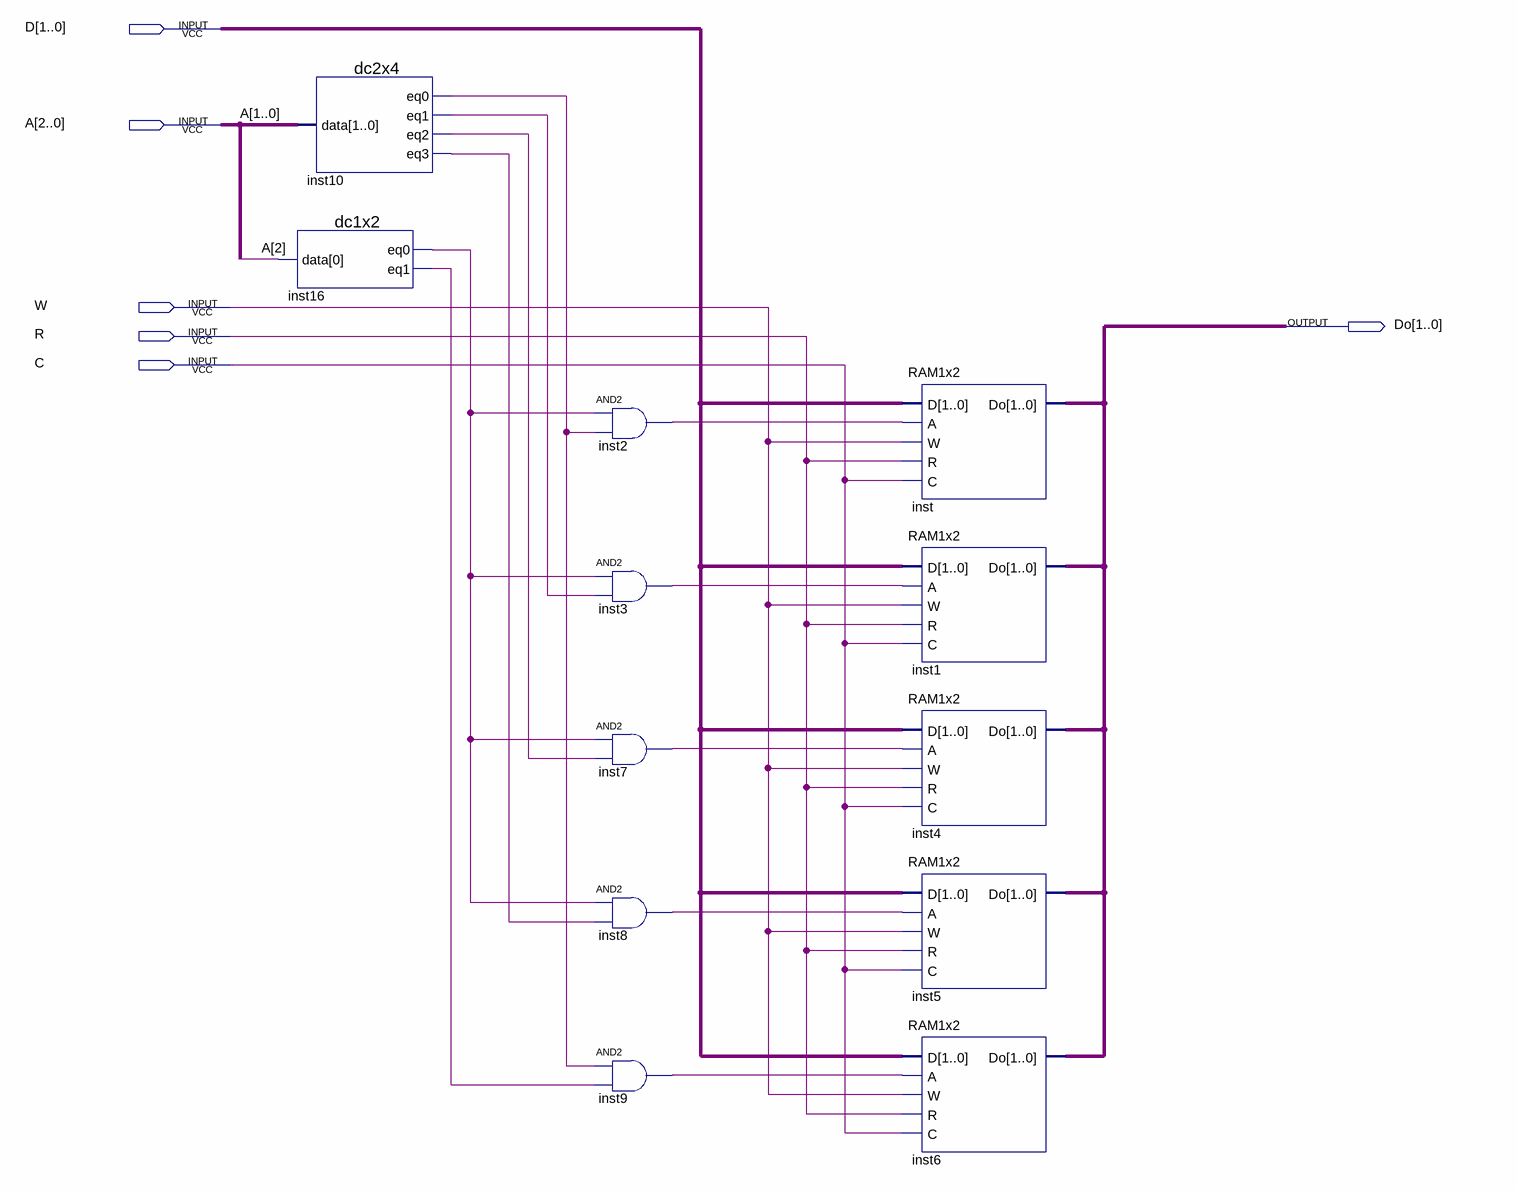
[diagram p0: schematic sheet]
// Quartus schematic RAM5x2_3D.bdf as structural Verilog: 12 symbols, 6 pins
module RAM5x2_3D (
  input  [1:0] D,
  input  [2:0] A,
  input  W,
  input  R,
  input  C,
  output [1:0] Do
);

  wire inst2_out, inst3_out, inst7_out, inst8_out, inst9_out, inst10_eq0, inst10_eq1, inst10_eq2, inst10_eq3,
       inst16_eq0, inst16_eq1;

  dc1x2 inst16 (.data(A[2]), .eq0(inst16_eq0), .eq1(inst16_eq1));
  dc2x4 inst10 (.data(A[1:0]), .eq0(inst10_eq0), .eq1(inst10_eq1), .eq2(inst10_eq2), .eq3(inst10_eq3));
  and inst2 (inst2_out, inst16_eq0, inst10_eq0);
  and inst3 (inst3_out, inst16_eq0, inst10_eq1);
  and inst7 (inst7_out, inst16_eq0, inst10_eq2);
  and inst8 (inst8_out, inst16_eq0, inst10_eq3);
  and inst9 (inst9_out, inst10_eq0, inst16_eq1);
  RAM1x2 inst (.D(D), .A(inst2_out), .W(W), .R(R), .C(C), .Do(Do));
  RAM1x2 inst1 (.D(D), .A(inst3_out), .W(W), .R(R), .C(C), .Do(Do));
  RAM1x2 inst4 (.D(D), .A(inst7_out), .W(W), .R(R), .C(C), .Do(Do));
  RAM1x2 inst5 (.D(D), .A(inst8_out), .W(W), .R(R), .C(C), .Do(Do));
  RAM1x2 inst6 (.D(D), .A(inst9_out), .W(W), .R(R), .C(C), .Do(Do));
endmodule
